# Altium schematic sheet SHDN-CURRENT-S07-V00-LEMInterface.SchDoc: Current Sensor Interface
size A3; DrawnBy: Jonn Dillon; DocumentNumber: 6; SheetNumber: 6; SheetTotal: 14; Project: Shutdown Current Board 2020
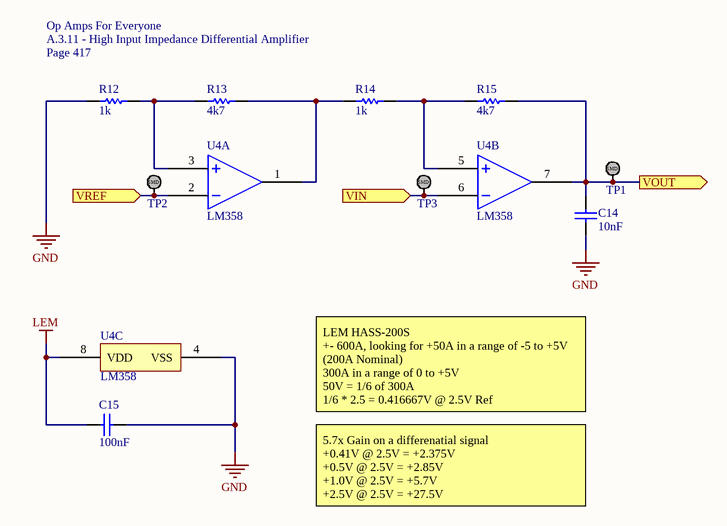
[diagram p0: SHDN-CURRENT-S07-V00-LEMInterface.SchDoc]

## Parts
C14  10nF  [Cap_Ceramic_0603]
C15  100nF  [Cap_Ceramic_0603]
R12  1k  [Res_ThinFilm_0603]
R13  4k7  [Res_ThinFilm_0603]
R14  1k  [Res_ThinFilm_0603]
R15  4k7  [Res_ThinFilm_0603]
TP1  TestPoint_SMD  [TestPointSMD]  (value not drawn)
TP2  TestPoint_SMD  [TestPointSMD]  (value not drawn)
TP3  TestPoint_SMD  [TestPointSMD]  (value not drawn)
U4  LM358  [TSSOP-8]  (parts A,B,C of 3)

## Ports
VIN (in), VOUT (out), VREF (in)

## Nets
GND: C14.1 C15.2 R12.1 U4.4(VSS)
LEM: C15.1 U4.8(VDD)
VIN: TP3.1 U4.6(IN2-) ; port VIN
VOUT: C14.2 R15.2 TP1.1 U4.7(OUT1) ; port VOUT
VREF: TP2.1 U4.2(IN1-) ; port VREF
NetR12_2: R12.2 R13.1 U4.3(IN1+)
NetR13_2: R13.2 R14.1 U4.1(OUT1)
NetR14_2: R14.2 R15.1 U4.5(IN2+)

## Notes on the sheet
- Op Amps For Everyone
- A.3.11 - High Input Impedance Differential Amplifier
- (near R12) Page 417
- LEM HASS-200S
  +- 600A, looking for +50A in a range of -5 to +5V
  (200A Nominal)
  300A in a range of 0 to +5V
  50V = 1/6 of 300A
  1/6 * 2.5 = 0.416667V @ 2.5V Ref
- 5.7x Gain on a differenatial signal
  +0.41V @ 2.5V = +2.375V
  +0.5V @ 2.5V = +2.85V
  +1.0V @ 2.5V = +5.7V
  +2.5V @ 2.5V = +27.5V
- Revision History:
- Sheet Title:
- Rev
- Date
- Description
- Project:
- Size:
- Drawn By:
- A3
- Number:
- Revision:
- Sheet
- Version:
- of
- QUT Motorsport
- O-120, Gardens Point
- 2 George Street
- Brisbane, QLD 4000
- Australia
- Print Date:
- Print Time:
- File Name:
- (in symbol TestPoint_SMD) SMD

## Library data of the parts
C14 = 10nF 50V 5% X7R 0603: Capacitor, Ceramic, SMD, 10nF, 50V, 5%, X7R, 0603
C15 = 100nF 50V 5% X7R 0603: Capacitor, Ceramic, SMD, 100nF, 50V, 5%, X7R, 0603
R12 R14 = 1k 5% 0603: Resistor, SMD, 1k, 0.1W, 5%, 0603
R13 R15 = 4k7 5% 0603: Resistor, SMD, 4k7, 0.1W, 5%, 0603
U4 = LM358: General Purpose Amplifier 2 Circuit 8-SOIC